# Altium schematic sheet Phaser.schdoc: Phaser
size 420 x 297 mm; EDA_Number: ARTIQ; Projet: ARTIQ/SINARA; Author: G.Kasprowicz; CompanyName: WUT ISE; DrawnBy: G.Kasprowicz; Organization: WUT ISE; Address1: PW ISE; Address2: Nowowiejska 15/19 00-665 Warsaw; Address3: gkasprow@gmail.com; Revision: 2; SheetNumber: -; SheetTotal: -; ModifiedBy: -; CheckedDate: -; Title2: xxx; DivGrp: WUT ISE; Designer: G.Kasprowicz; ModifiedDate: -; ProjectName: Sensor Box
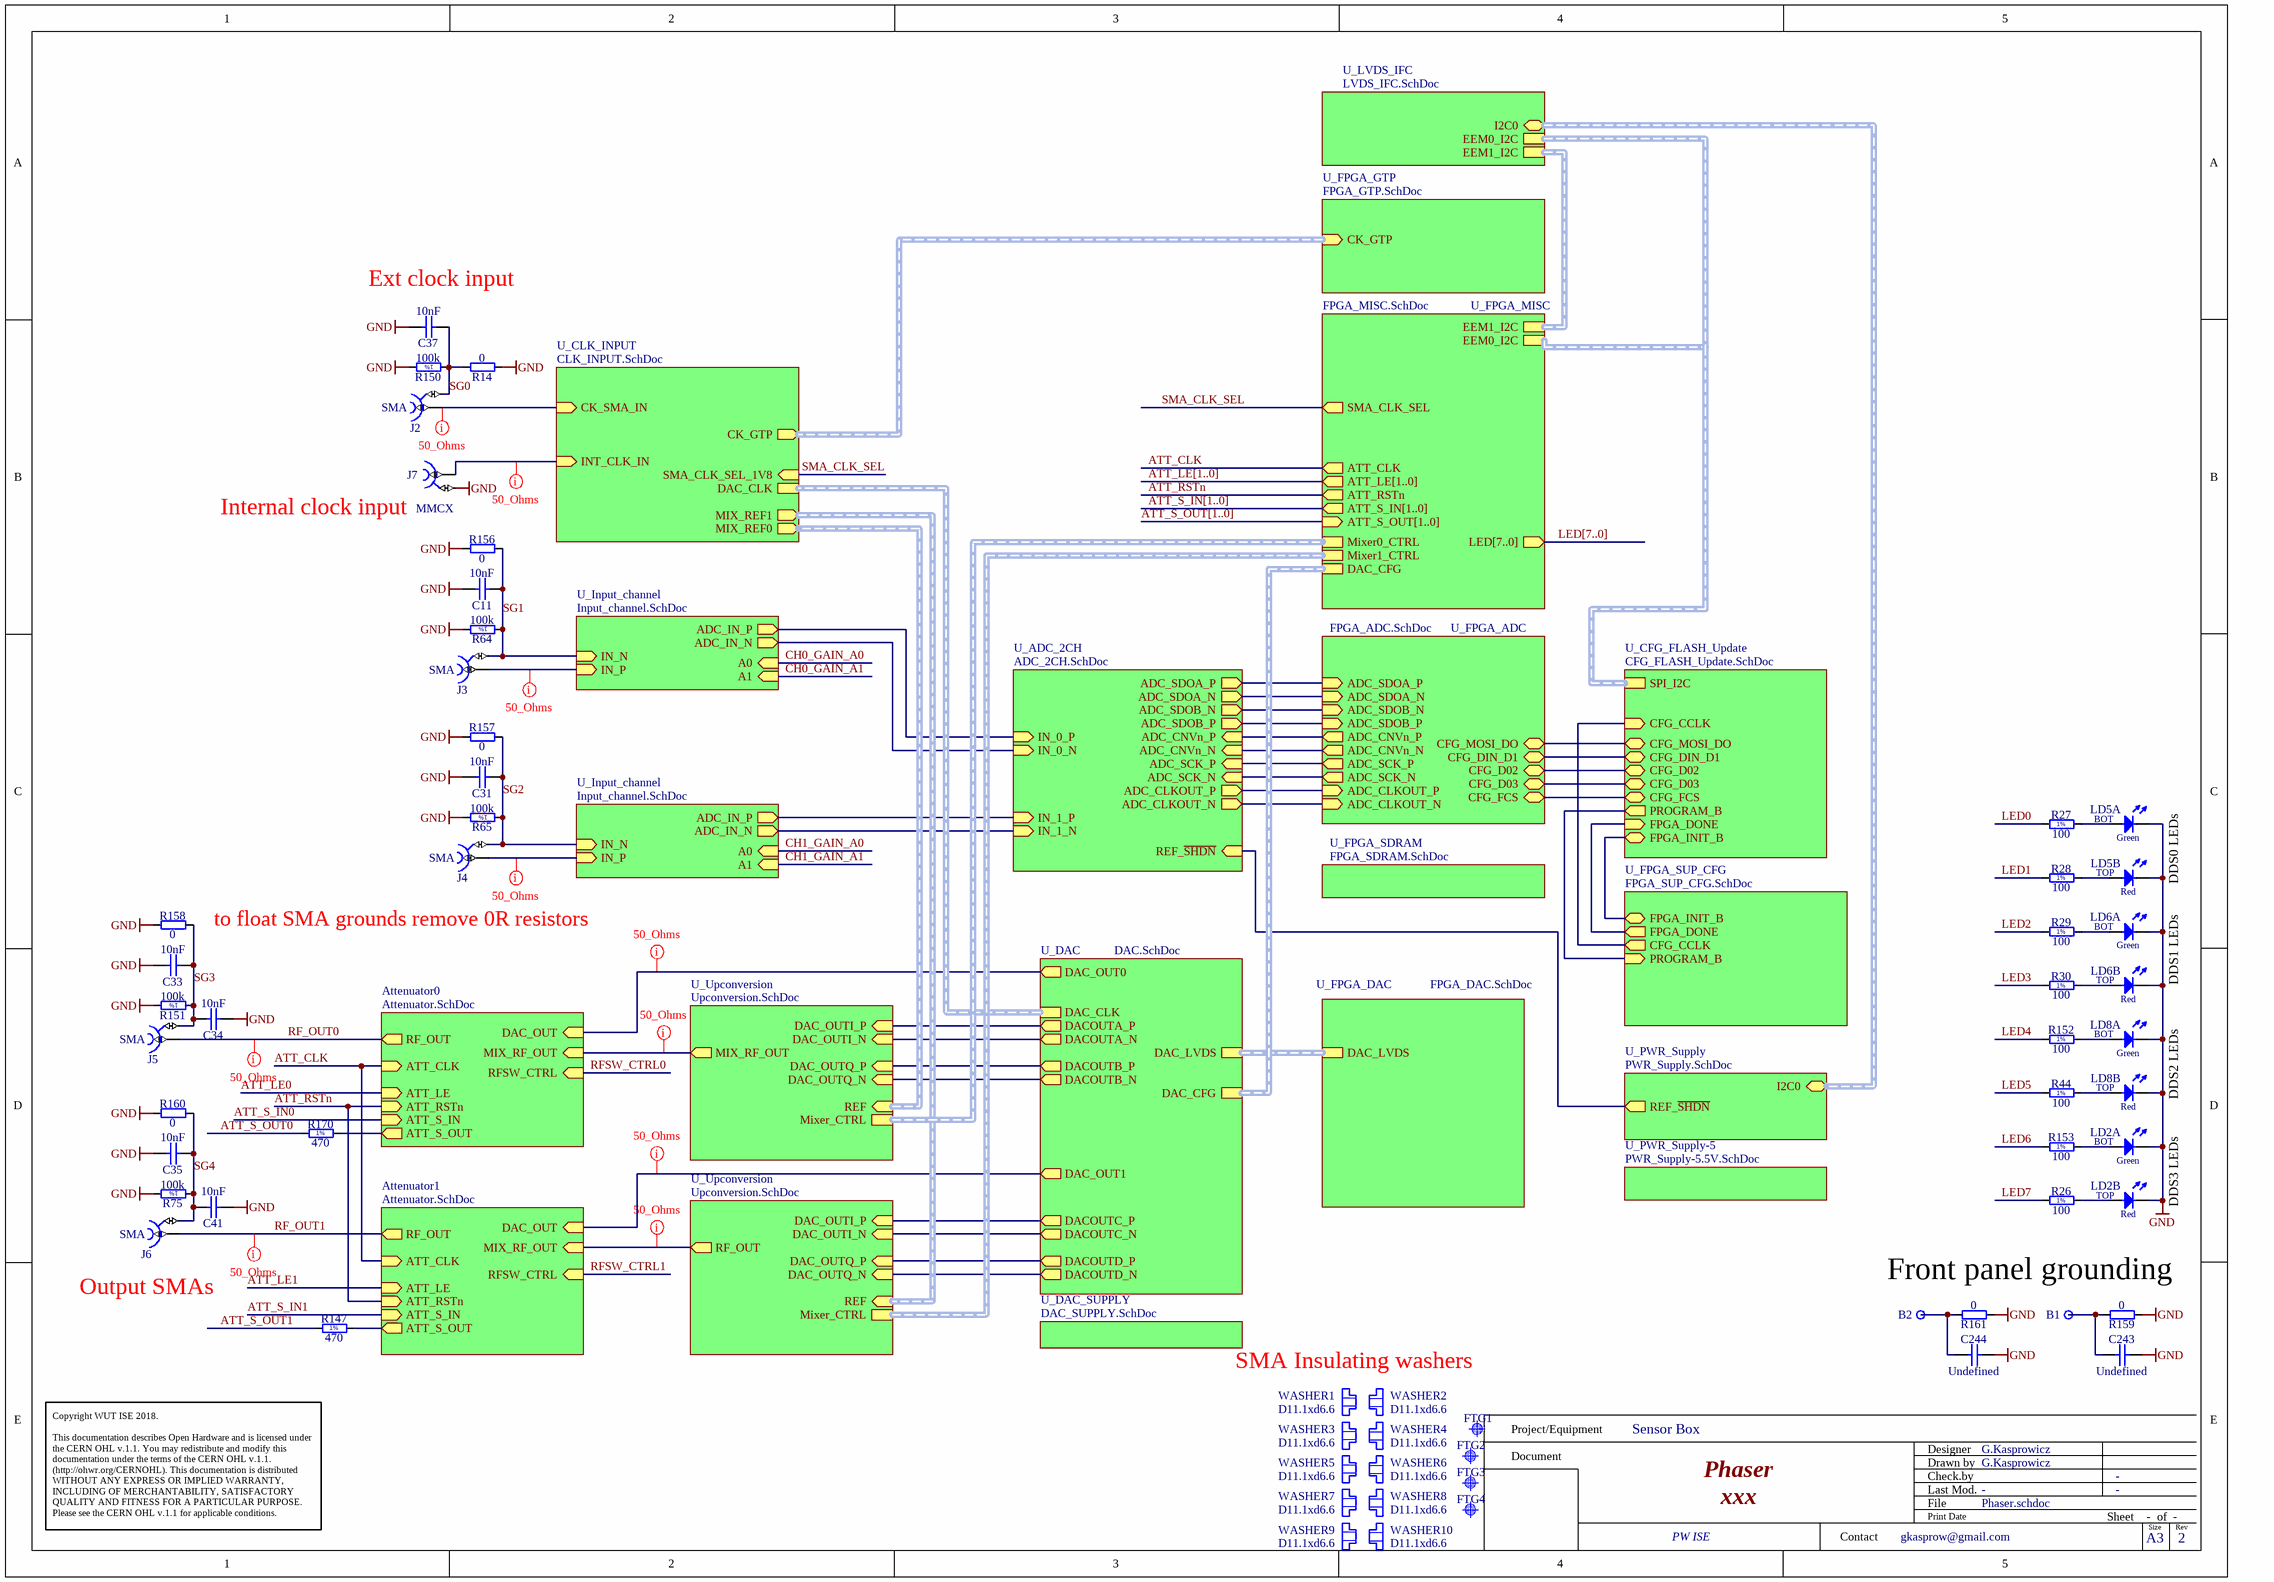
[diagram p0: Phaser.schdoc]

## Parts
B1  Plated Hole  [MTG270_500]  (value not drawn)
B2  Plated Hole  [MTG270_500]  (value not drawn)
C11  10nF  [CAPC1005X55N]
C31  10nF  [CAPC1005X55N]
C33  10nF  [CAPC1005X55N]
C34  10nF  [CAPC1005X55N]
C35  10nF  [CAPC1005X55N]
C37  10nF  [CAPC1005X55N]
C41  10nF  [CAPC1005X55N]
C243  Undefined  [CAPC2012X135N]
C244  Undefined  [CAPC2012X135N]
FTG1  Use only in PCB  [FIDUCIAL_TOP_C100-200]  (value not drawn)
FTG2  Use only in PCB  [FIDUCIAL_TOP_S100-200]  (value not drawn)
FTG3  Use only in PCB  [FIDUCIAL_TOP_S200-400]  (value not drawn)
FTG4  Use only in PCB  [FIDUCIAL_TOP_S100-200]  (value not drawn)
J2  SMA  [RF249BT0050GHDW]
J3  SMA  [RF249BT0050GHDW]
J4  SMA  [RF249BT0050GHDW]
J5  SMA  [RF249BT0050GHDW]
J6  SMA  [RF249BT0050GHDW]
J7  MMCX  [SAMTEC_MMCX-J-P-H-ST-TH1]
LD2  Red/Green  [LED_DIALIGHT_571-0112F]  (value not drawn)  (parts A,B of 2)
LD5  Red/Green  [LED_DIALIGHT_571-0112F]  (value not drawn)  (parts A,B of 2)
LD6  Red/Green  [LED_DIALIGHT_571-0112F]  (value not drawn)  (parts A,B of 2)
LD8  Red/Green  [LED_DIALIGHT_571-0112F]  (value not drawn)  (parts A,B of 2)
R14  0  [RESC1608X55N]
R26  100  [RESC1005X40N]
R27  100  [RESC1005X40N]
R28  100  [RESC1005X40N]
R29  100  [RESC1005X40N]
R30  100  [RESC1005X40N]
R44  100  [RESC1005X40N]
R64  100k  [RESC1005X40N]
R65  100k  [RESC1005X40N]
R75  100k  [RESC1005X40N]
R147  470  [RESC1005X40N]
R150  100k  [RESC1005X40N]
R151  100k  [RESC1005X40N]
R152  100  [RESC1005X40N]
R153  100  [RESC1005X40N]
R156  0  [RESC1608X55N]
R157  0  [RESC1608X55N]
R158  0  [RESC1608X55N]
R159  0  [RESC1608X55N]
R160  0  [RESC1608X55N]
R161  0  [RESC1608X55N]
R170  470  [RESC1005X40N]
WASHER1  D11.1xd6.6  [Keystone_7687]
WASHER2  D11.1xd6.6  [Keystone_7687]
WASHER3  D11.1xd6.6  [Keystone_7687]
WASHER4  D11.1xd6.6  [Keystone_7687]
WASHER5  D11.1xd6.6  [Keystone_7687]
WASHER6  D11.1xd6.6  [Keystone_7687]
WASHER7  D11.1xd6.6  [Keystone_7687]
WASHER8  D11.1xd6.6  [Keystone_7687]
WASHER9  D11.1xd6.6  [Keystone_7687]
WASHER10  D11.1xd6.6  [Keystone_7687]

## Sub-sheets
Attenuator0 = Attenuator.SchDoc: RF_OUT (out), RFSW_CTRL (in), ATT_CLK (in), ATT_S_IN (in), ATT_LE (in), ATT_RSTn (in), ATT_S_OUT (out), DAC_OUT (in), MIX_RF_OUT (in)
Attenuator1 = Attenuator.SchDoc: RF_OUT (out), RFSW_CTRL (in), ATT_CLK (in), ATT_S_IN (in), ATT_LE (in), ATT_RSTn (in), ATT_S_OUT (out), DAC_OUT (in), MIX_RF_OUT (in)
U_ADC_2CH = ADC_2CH.SchDoc: ADC_SDOA_P (out), ADC_SDOA_N (out), ADC_SDOB_N (out), ADC_SDOB_P (out), ADC_CLKOUT_P (out), ADC_CLKOUT_N (out), ADC_SCK_P (in), ADC_SCK_N (in), REF_~{SHDN} (in), ADC_CNVn_P (in), ADC_CNVn_N (in), IN_0_P (in), IN_1_P (in), IN_0_N (in), IN_1_N (in)
U_CFG_FLASH_Update = CFG_FLASH_Update.SchDoc: SPI_I2C (harness I2C), CFG_MOSI_DO (bidir), CFG_DIN_D1 (bidir), CFG_D02 (bidir), CFG_D03 (bidir), CFG_FCS (bidir), CFG_CCLK (in), FPGA_DONE (in), FPGA_INIT_B (bidir), PROGRAM_B (out)
U_CLK_INPUT = CLK_INPUT.SchDoc: CK_SMA_IN (in), INT_CLK_IN (in), SMA_CLK_SEL_1V8 (in), CK_GTP (out, harness CLKDIFF), MIX_REF0 (out), MIX_REF1 (out), DAC_CLK
U_DAC = DAC.SchDoc: DAC_CFG (harness DAC_CFG), DAC_LVDS (harness DAC_LVDS), DAC_CLK (harness CLKDIFF), DACOUTD_P (out), DACOUTA_P (out), DACOUTA_N (out), DACOUTD_N (out), DACOUTC_N (out), DACOUTC_P (out), DACOUTB_N (out), DACOUTB_P (out), DAC_OUT0 (out), DAC_OUT1 (out)
U_DAC_SUPPLY = DAC_SUPPLY.SchDoc: no entries
U_FPGA_ADC = FPGA_ADC.SchDoc: ADC_SDOA_P (in), ADC_SDOA_N (in), ADC_SDOB_N (in), ADC_SDOB_P (in), ADC_CNVn_P (out), ADC_CNVn_N (out), ADC_SCK_P (out), ADC_SCK_N (out), ADC_CLKOUT_P (in), ADC_CLKOUT_N (in), CFG_DIN_D1 (bidir), CFG_FCS (bidir), CFG_MOSI_DO (bidir), CFG_D02 (bidir), CFG_D03 (bidir)
U_FPGA_DAC = FPGA_DAC.SchDoc: DAC_LVDS
U_FPGA_GTP = FPGA_GTP.SchDoc: CK_GTP (in, harness CLKDIFF)
U_FPGA_MISC = FPGA_MISC.SchDoc: SMA_CLK_SEL (out), ATT_CLK (out), ATT_RSTn (out), ATT_LE[1..0] (out), ATT_S_IN[1..0] (out), ATT_S_OUT[1..0] (in), DAC_CFG (harness SPI), LED[7..0] (out), EEM1_I2C (harness I2C), EEM0_I2C (harness I2C), Mixer1_CTRL, Mixer0_CTRL
U_FPGA_SDRAM = FPGA_SDRAM.SchDoc: no entries
U_FPGA_SUP_CFG = FPGA_SUP_CFG.SchDoc: FPGA_INIT_B (bidir), FPGA_DONE (out), CFG_CCLK (out), PROGRAM_B (in)
U_Input_channel = Input_channel.SchDoc: IN_N (in), A0 (in), A1 (in), IN_P (in), ADC_IN_P (out), ADC_IN_N (out)
U_Input_channel = Input_channel.SchDoc: IN_N (in), A0 (in), A1 (in), IN_P (in), ADC_IN_P (out), ADC_IN_N (out)
U_LVDS_IFC = LVDS_IFC.SchDoc: I2C0 (bidir, harness I2C), EEM1_I2C, EEM0_I2C
U_PWR_Supply = PWR_Supply.SchDoc: I2C0 (bidir), REF_~{SHDN} (out)
U_PWR_Supply-5 = PWR_Supply-5.5V.SchDoc: no entries
U_Upconversion = Upconversion.SchDoc: DAC_OUTI_P (in), DAC_OUTI_N (in), DAC_OUTQ_N (in), DAC_OUTQ_P (in), REF (in, harness CLKDIFF), MIX_RF_OUT (out), Mixer_CTRL (harness Mixer_CTRL)
U_Upconversion = Upconversion.SchDoc: DAC_OUTI_P (in), DAC_OUTI_N (in), DAC_OUTQ_N (in), DAC_OUTQ_P (in), REF (in, harness CLKDIFF), RF_OUT (out), Mixer_CTRL (harness Mixer_CTRL)

## Nets
GND: C11.2 C31.2 C33.2 C34.1 C35.2 C37.2 C41.1 C243.2 C244.2 J7.2 LD2.1(C) LD2.3(C) LD5.1(C) LD5.3(C) LD6.1(C) LD6.3(C) LD8.1(C) LD8.3(C) R14.1 R64.1 R65.1 R75.1 R150.1 R151.1 R156.1 R157.1 R158.1 R159.1 R160.1 R161.1
ATT_CLK: sheet Attenuator0/ATT_CLK, sheet Attenuator1/ATT_CLK, sheet U_FPGA_MISC/ATT_CLK
ATT_LE0: sheet Attenuator0/ATT_LE
ATT_LE1: sheet Attenuator1/ATT_LE
ATT_RSTn: sheet Attenuator0/ATT_RSTn, sheet Attenuator1/ATT_RSTn, sheet U_FPGA_MISC/ATT_RSTn
ATT_S_IN0: sheet Attenuator0/ATT_S_IN
ATT_S_IN1: sheet Attenuator1/ATT_S_IN
ATT_S_OUT0: R170.1
ATT_S_OUT1: R147.1
CH0_GAIN_A0: sheet U_Input_channel/A0
CH0_GAIN_A1: sheet U_Input_channel/A1
CH1_GAIN_A0: sheet U_Input_channel/A0
CH1_GAIN_A1: sheet U_Input_channel/A1
LED0: R27.1
LED1: R28.1
LED2: R29.1
LED3: R30.1
LED4: R152.1
LED5: R44.1
LED6: R153.1
LED7: R26.1
RF_OUT0: J5.1 ; sheet Attenuator0/RF_OUT
RF_OUT1: J6.1 ; sheet Attenuator1/RF_OUT
RFSW_CTRL0: sheet Attenuator0/RFSW_CTRL
RFSW_CTRL1: sheet Attenuator1/RFSW_CTRL
SG0: C37.1 J2.2 R14.2 R150.2
SG1: C11.1 J3.2 R64.2 R156.2 ; sheet U_Input_channel/IN_N
SG2: C31.1 J4.2 R65.2 R157.2 ; sheet U_Input_channel/IN_N
SG3: C33.1 C34.2 J5.2 R151.2 R158.2
SG4: C35.1 C41.2 J6.2 R75.2 R160.2
SMA_CLK_SEL: sheet U_FPGA_MISC/SMA_CLK_SEL, sheet U_CLK_INPUT/SMA_CLK_SEL_1V8
NetB1_1: B1.1 C243.1 R159.2
NetB2_1: B2.1 C244.1 R161.2
NetJ2_1: J2.1 ; sheet U_CLK_INPUT/CK_SMA_IN
NetJ3_1: J3.1 ; sheet U_Input_channel/IN_P
NetJ4_1: J4.1 ; sheet U_Input_channel/IN_P
NetJ7_1: J7.1 ; sheet U_CLK_INPUT/INT_CLK_IN
NetLD2_2: LD2.2(A) R153.2
NetLD2_4: LD2.4(A) R26.2
NetLD5_2: LD5.2(A) R27.2
NetLD5_4: LD5.4(A) R28.2
NetLD6_2: LD6.2(A) R29.2
NetLD6_4: LD6.4(A) R30.2
NetLD8_2: LD8.2(A) R152.2
NetLD8_4: LD8.4(A) R44.2
NetR147_2: R147.2 ; sheet Attenuator1/ATT_S_OUT
NetR170_2: R170.2 ; sheet Attenuator0/ATT_S_OUT
(unnamed): sheet Attenuator0/DAC_OUT, sheet U_DAC/DAC_OUT0
(unnamed): sheet Attenuator0/MIX_RF_OUT, sheet U_Upconversion/MIX_RF_OUT
(unnamed): sheet Attenuator1/DAC_OUT, sheet U_DAC/DAC_OUT1
(unnamed): sheet Attenuator1/MIX_RF_OUT, sheet U_Upconversion/RF_OUT
(unnamed): sheet U_PWR_Supply/REF_~{SHDN}, sheet U_ADC_2CH/REF_~{SHDN}
(unnamed): sheet U_ADC_2CH/ADC_SDOA_P, sheet U_FPGA_ADC/ADC_SDOA_P
(unnamed): sheet U_ADC_2CH/ADC_SDOA_N, sheet U_FPGA_ADC/ADC_SDOA_N
(unnamed): sheet U_ADC_2CH/ADC_SDOB_N, sheet U_FPGA_ADC/ADC_SDOB_N
(unnamed): sheet U_ADC_2CH/ADC_SDOB_P, sheet U_FPGA_ADC/ADC_SDOB_P
(unnamed): sheet U_ADC_2CH/ADC_CLKOUT_P, sheet U_FPGA_ADC/ADC_CLKOUT_P
(unnamed): sheet U_ADC_2CH/ADC_CLKOUT_N, sheet U_FPGA_ADC/ADC_CLKOUT_N
(unnamed): sheet U_ADC_2CH/ADC_SCK_P, sheet U_FPGA_ADC/ADC_SCK_P
(unnamed): sheet U_ADC_2CH/ADC_SCK_N, sheet U_FPGA_ADC/ADC_SCK_N
(unnamed): sheet U_ADC_2CH/ADC_CNVn_P, sheet U_FPGA_ADC/ADC_CNVn_P
(unnamed): sheet U_ADC_2CH/ADC_CNVn_N, sheet U_FPGA_ADC/ADC_CNVn_N
(unnamed): sheet U_ADC_2CH/IN_0_P, sheet U_Input_channel/ADC_IN_P
(unnamed): sheet U_ADC_2CH/IN_1_P, sheet U_Input_channel/ADC_IN_P
(unnamed): sheet U_ADC_2CH/IN_0_N, sheet U_Input_channel/ADC_IN_N
(unnamed): sheet U_ADC_2CH/IN_1_N, sheet U_Input_channel/ADC_IN_N
(unnamed): sheet U_DAC/DACOUTD_P, sheet U_Upconversion/DAC_OUTQ_P
(unnamed): sheet U_DAC/DACOUTA_P, sheet U_Upconversion/DAC_OUTI_P
(unnamed): sheet U_DAC/DACOUTA_N, sheet U_Upconversion/DAC_OUTI_N
(unnamed): sheet U_DAC/DACOUTD_N, sheet U_Upconversion/DAC_OUTQ_N
(unnamed): sheet U_DAC/DACOUTC_N, sheet U_Upconversion/DAC_OUTI_N
(unnamed): sheet U_DAC/DACOUTC_P, sheet U_Upconversion/DAC_OUTI_P
(unnamed): sheet U_DAC/DACOUTB_N, sheet U_Upconversion/DAC_OUTQ_N
(unnamed): sheet U_DAC/DACOUTB_P, sheet U_Upconversion/DAC_OUTQ_P
(unnamed): sheet U_FPGA_ADC/CFG_DIN_D1, sheet U_CFG_FLASH_Update/CFG_DIN_D1
(unnamed): sheet U_FPGA_ADC/CFG_FCS, sheet U_CFG_FLASH_Update/CFG_FCS
(unnamed): sheet U_FPGA_ADC/CFG_MOSI_DO, sheet U_CFG_FLASH_Update/CFG_MOSI_DO
(unnamed): sheet U_FPGA_ADC/CFG_D02, sheet U_CFG_FLASH_Update/CFG_D02
(unnamed): sheet U_FPGA_ADC/CFG_D03, sheet U_CFG_FLASH_Update/CFG_D03
(unnamed): sheet U_FPGA_SUP_CFG/FPGA_INIT_B, sheet U_CFG_FLASH_Update/FPGA_INIT_B
(unnamed): sheet U_FPGA_SUP_CFG/FPGA_DONE, sheet U_CFG_FLASH_Update/FPGA_DONE
(unnamed): sheet U_FPGA_SUP_CFG/CFG_CCLK, sheet U_CFG_FLASH_Update/CFG_CCLK
(unnamed): sheet U_FPGA_SUP_CFG/PROGRAM_B, sheet U_CFG_FLASH_Update/PROGRAM_B

## Buses and harness runs
bus ATT_LE[1..0] = sheet U_FPGA_MISC/ATT_LE[1..0]
bus ATT_S_IN[1..0] = sheet U_FPGA_MISC/ATT_S_IN[1..0]
bus ATT_S_OUT[1..0] = sheet U_FPGA_MISC/ATT_S_OUT[1..0]
bus LED[7..0] = sheet U_FPGA_MISC/LED[7..0]
harness sheet U_CFG_FLASH_Update/SPI_I2C = sheet U_FPGA_MISC/EEM0_I2C = sheet U_LVDS_IFC/EEM0_I2C
harness sheet U_CLK_INPUT/CK_GTP = sheet U_FPGA_GTP/CK_GTP
harness sheet U_CLK_INPUT/DAC_CLK = sheet U_DAC/DAC_CLK
harness sheet U_CLK_INPUT/MIX_REF0 = sheet U_Upconversion/REF
harness sheet U_CLK_INPUT/MIX_REF1 = sheet U_Upconversion/REF
harness sheet U_DAC/DAC_CFG = sheet U_FPGA_MISC/DAC_CFG
harness sheet U_DAC/DAC_LVDS = sheet U_FPGA_DAC/DAC_LVDS
harness sheet U_FPGA_MISC/EEM1_I2C = sheet U_LVDS_IFC/EEM1_I2C
harness sheet U_FPGA_MISC/Mixer0_CTRL = sheet U_Upconversion/Mixer_CTRL
harness sheet U_FPGA_MISC/Mixer1_CTRL = sheet U_Upconversion/Mixer_CTRL
harness sheet U_LVDS_IFC/I2C0 = sheet U_PWR_Supply/I2C0

## Layout directives
net class 50_Ohms: (no net found under the mark), NetJ2_1, NetJ3_1, NetJ4_1, NetJ7_1, RF_OUT0, RF_OUT1

## Notes on the sheet
- (near C37) Ext clock input
- (near J7) Internal clock input
- (near LD5) DDS0 LEDs
- (near LD6) DDS1 LEDs
- (near LD8) DDS2 LEDs
- (near LD2) DDS3 LEDs
- (near J6) Output SMAs
- Front panel grounding
- SMA Insulating washers
- Labels drawn without touching a wire or pin: to float SMA grounds remove 0R resistors
- Project/Equipment
- Document
- Designer
- Drawn by
- Check.by
- Copyright WUT ISE 2018.
  This documentation describes Open Hardware and is licensed under the CERN OHL v.1.1. You may redistribute and modify this documentation under the terms of the CERN OHL v.1.1. (http://ohwr.org/CERNOHL). This documentation is distributed WITHOUT ANY EXPRESS OR IMPLIED WARRANTY, INCLUDING OF MERCHANTABILITY, SATISFACTORY QUALITY AND FITNESS FOR A PARTICULAR PURPOSE. Please see the CERN OHL v.1.1 for applicable conditions.
- Contact
- File
- Last Mod.
- Print Date
- Sheet
- Size
- A3
- of
- Rev
- (in symbol LED_DIALIGHT_571-0112F, part A) BOT; Green
- (in symbol LED_DIALIGHT_571-0112F, part B) TOP; Red
- (in symbol R0402_100K_1%_0.0625W_100PPM) 1%
- (in symbol R0402_100R_1%_0.0625W_100PPM) 1%
- (in symbol R0402_470R_1%_0.0625W_100PPM) 1%

## Library data of the parts
B1 B2 = PLATED_HOLE2.7_PAD5.0: Single Terminal Socket; Part Description: Plated Through Hole: Hole Dia.=2.7mm Pad Dia.=5.0mm; Mounted: No; Part Number: PLATED_HOLE2.7_PAD5.0; Component Kind: Standard (No BOM); Component Type: Standard (No BOM); Pin Count: 1; Family: Plated Hole; Socket: No; SMD: No; Sense: No; Status: None; ComponentHeight: 0mm; HelpURL: Undefined; Author: CERN DEM JMW; CreateDate: 27.09.2011; LatestRevisionDate: 27.09.2011; PackageDescription: Plated Through Hole: Hole Dia.=2.7mm Pad Dia.=5.0mm
C11 C31 C33-C35 C37 C41 = CC0402_10NF_16V_10%_X7R: Non-polarised capacitor; Part Description: SMD Multilayer Chip Ceramic Capacitor; Manufacturer: GENERIC; Manufacturer1 Part Number: 223878715636; Voltage: 16V; TC: X7R; Tolerance: ±10%; Part Number: CC0402_10NF_16V_10%_X7R; Component Kind: Standard; Component Type: Standard; Pin Count: 2; Value: 10nF; Status: Not Recommended; Manufacturer Part Number: CC0402_10NF_16V_10%_X7R; Case: 0402; Mounted: Yes; Socket: No; SMD: Yes; Sense: No; Manufacturer1 Example: PHYCOMP; Manufacturer1 ComponentHeight: 0.55mm; HelpURL: \\cern.ch\dfs\Applications\Altium\Datasheets\CC0402_X7R_PHYCOMP.pdf; Author: CERN DEM JLC; CreateDate: 2007-12-03; LatestRevisionDate: 2007-12-03
C243 C244 = CC0805_NO-VALUE: Non-polarised capacitor; Part Description: Reserved Footprint For 0805(2012) Chip Ceramic Capacitor; Mounted: No; Part Number: CC0805_NO-VALUE; Component Kind: Standard; Component Type: Standard; Pin Count: 2; Value: Undefined; Status: None; Manufacturer: Undefined; Manufacturer Part Number: CC0805_NO-VALUE; Case: 0805; Socket: No; SMD: Yes; Sense: No; Manufacturer1 ComponentHeight: 1.35mm; HelpURL: Undefined; Author: CERN DEM JLC; CreateDate: 10.12.2008; LatestRevisionDate: 11.09.2013
FTG1 = FIDUCIAL_TARGET_C100-200: Fiducial Target; Part Description: Round Fiducial Target, Top Layer, 1.0mm, Top Solder 2.0mm, Keepout =2.0mm; Mounted: No; Part Number: FIDUCIAL_TARGET_C100-200; Component Kind: Standard (No BOM); Component Type: Standard (No BOM); Pin Count: 1; Family: Fiducial; Socket: No; SMD: Yes; Sense: No; Status: None; ComponentHeight: 0mm; HelpURL: Undefined; Author: CERN DEM JLC; CreateDate: 09.02.2010; LatestRevisionDate: 04.04.2012; PackageDescription: Round Fiducial Target, Top Layer, 1.0mm, Top Solder 2.0mm, Keepout =2.0mm
FTG2 FTG4 = FIDUCIAL_TARGET_S100-200: Fiducial Target; Part Description: Square Fiducial Target, Top Layer, 1.0mm, Top Solder 2.0mm, Keepout =2.0mm; Mounted: No; Part Number: FIDUCIAL_TARGET_S100-200; Component Kind: Standard (No BOM); Component Type: Standard (No BOM); Pin Count: 1; Family: Fiducial; Socket: No; SMD: Yes; Sense: No; Status: None; ComponentHeight: 0mm; HelpURL: Undefined; Author: CERN DEM JLC; CreateDate: 09.02.2010; LatestRevisionDate: 04.04.2012; PackageDescription: Square Fiducial Target, Top Layer, 1.0mm, Top Solder 2.0mm, Keepout =2.0mm
FTG3 = FIDUCIAL_TARGET_S200-400: Fiducial Target; Part Description: Square Fiducial Target, Top Layer, 2.0mm, Top Solder 4.0mm, Keepout =4.0mm; Mounted: No; Part Number: FIDUCIAL_TARGET_S200-400; Component Kind: Standard (No BOM); Component Type: Standard (No BOM); Pin Count: 1; Family: Fiducial; Socket: No; SMD: Yes; Sense: No; Status: None; ComponentHeight: 0mm; HelpURL: Undefined; Author: CERN DEM JLC; CreateDate: 02.06.2008; LatestRevisionDate: 04.04.2012; PackageDescription: Square Fiducial Target, Top Layer, 2.0mm, Top Solder 4.0mm, Keepout =4.0mm
J2-J6 = CON_SMA_RF249BT0050GHDW: 50 Ohm Through Hole SMA Right Angle PCB Jack; Part Number: AdamTech_RF249BT0050GHDW; Manufacturer: AdamTech; PressFit: No; Component Kind: Standard; Component Type: Standard; Pin Count: 5; Family: SMA; Mounted: Yes; Socket: No; SMD: No; Sense: No; Status: None; Part Description: 50 Ohm Through Hole SMA Right Angle PCB Jack; Manufacturer Part Number: RF249BT0050GHDW; ComponentHeight: 10.44mm; HelpURL: \\cern.ch\dfs\Applications\Altium\Datasheets\AMPHENOL_132203.pdf; Author: GK; CreateDate: 06.10.2016; LatestRevisionDate: 06.10.2016
J7 = SAMTEC_MMCX-J-P-H-ST-TH1: Part Description: Straight Through-hole 50 Ohm Micro Mini RF Jack, MMCX Series; Manufacturer: SAMTEC; PressFit: No; Part Number: SAMTEC_MMCX-J-P-H-ST-TH1; Component Kind: Standard; Component Type: Standard; Pin Count: 2; Mounted: Yes; Socket: No; Sense: No; SMD: No; Status: None; Manufacturer Part Number: MMCX-J-P-H-ST-TH1; ComponentHeight: 4.35mm; HelpURL: \\cern.ch\dfs\Applications\Altium\Datasheets\SAMTEC_MMCX-J-P-H-ST-TH1.pdf; Author: CERN DEM JLC; CreateDate: 05.12.2012; LatestRevisionDate: 05.12.2012
LD2 LD5 LD6 LD8 = LED_DIALIGHT_571-0112F: 2x LED  Botom Green, Top Red; Part Description: Dual 2mm  LEDs, Red Top,Green Bot, CBI® Circuit Board Indicator (Without positioning pins); PressFit: No; Bonding: No; Part Number: LED_DIALIGHT_571-0112F; Component Kind: Standard; Component Type: Standard; Color: Red/Green; PackageDescription: 2x 2mm LED (Top: Red, Bot: Green) PCB Edge Mounting (Without positioning pins) DIALIGHT 571 Serie; Manufacturer: DIALIGHT; Manufacturer Part Number: 571-0112F; Pin Count: 4; Mounted: Yes; Socket: No; SMD: No; Sense: No; ComponentHeight: 8.6mm; HelpURL: \\cern.ch\dfs\Applications\Altium\Datasheets\LED_DIALIGHT_571-0112F.pdf; Author: CERN DEM JLC; CreateDate: 09.11.2009; LatestRevisionDate: 17.03.2010
R14 R156-R161 = R0603_0R_JUMPER: Resistor; Part Description: 1A (0.05R Max DC Resistance) Zero Ohm Jumper; Manufacturer: GENERIC; Manufacturer1 Part Number: NRC06Z0; PressFit: No; Part Number: R0603_0R_JUMPER; Component Kind: Standard; Component Type: Standard; Pin Count: 2; Value: 0; Status: Preferred; Manufacturer Part Number: R0603_0R_JUMPER; Case: 0603; Mounted: Yes; Sense: No; Socket: No; SMD: Yes; Manufacturer1 Example: NIC COMPONENT; Manufacturer1 ComponentHeight: 0.55mm; HelpURL: \\cern.ch\dfs\Applications\Altium\Datasheets\R0603_NIC_NRC.pdf; Author: CERN DEM JLC; CreateDate: 03.12.2007; LatestRevisionDate: 13.03.2008
R26-R30 R44 R152 R153 = R0402_100R_1%_0.0625W_100PPM: Resistor - 1%; Part Description: General Purpose Thick Film Chip Resistor; Manufacturer: GENERIC; Manufacturer1 Part Number: 232270671001L; TC: ±100ppm/°C; PressFit: No; Part Number: R0402_100R_1%_0.0625W_100PPM; Component Kind: Standard; Component Type: Standard; Pin Count: 2; Value: 100; Status: Not Recommended; Power: 0.0625W; Tolerance: ±1%; Manufacturer Part Number: R0402_100R_1%_0.0625W_100PPM; Case: 0402; Mounted: Yes; Sense: No; Socket: No; SMD: Yes; Manufacturer1 Example: YAGEO PHYCOMP; Manufacturer1 ComponentHeight: 0.4mm; HelpURL: \\cern.ch\dfs\Applications\Altium\Datasheets\R0402_Phycomp_RC0402.pdf; Author: CERN DEM JLC; CreateDate: 03.12.2007; LatestRevisionDate: 17.10.2012
R64 R65 R75 R150 R151 = R0402_100K_1%_0.0625W_100PPM: Resistor - 1%; Part Description: General Purpose Thick Film Chip Resistor; Manufacturer: GENERIC; Manufacturer1 Part Number: 232270671004L; PressFit: No; TC: ±100ppm/°C; Part Number: R0402_100K_1%_0.0625W_100PPM; Component Kind: Standard; Component Type: Standard; Pin Count: 2; Value: 100k; Status: Not Recommended; Manufacturer Part Number: R0402_100K_1%_0.0625W_100PPM; Case: 0402; Mounted: Yes; Sense: No; Socket: No; SMD: Yes; Manufacturer1 Example: YAGEO PHYCOMP; Manufacturer1 ComponentHeight: 0.4mm; HelpURL: \\cern.ch\dfs\Applications\Altium\Datasheets\R0402_Phycomp_RC0402.pdf; Author: CERN DEM JLC; CreateDate: 03.12.2007; LatestRevisionDate: 17.10.2012; Power: 0.0625W; Tolerance: ±1%
R147 R170 = R0402_470R_1%_0.0625W_100PPM: Resistor - 1%; Part Description: General Purpose Thick Film Chip Resistor; Manufacturer: GENERIC; Manufacturer1 Part Number: 232270674701L; TC: ±100ppm/°C; PressFit: No; Part Number: R0402_470R_1%_0.0625W_100PPM; Component Kind: Standard; Component Type: Standard; Pin Count: 2; Value: 470; Status: Not Recommended; Power: 0.0625W; Tolerance: ±1%; Manufacturer Part Number: R0402_470R_1%_0.0625W_100PPM; Case: 0402; Mounted: Yes; Sense: No; Socket: No; SMD: Yes; Manufacturer1 Example: YAGEO PHYCOMP; Manufacturer1 ComponentHeight: 0.4mm; HelpURL: \\cern.ch\dfs\Applications\Altium\Datasheets\R0402_Phycomp_RC0402.pdf; Author: CERN DEM JLC; CreateDate: 03.12.2007; LatestRevisionDate: 17.10.2012
WASHER1-WASHER10 = Keystone_7687: SMA_Shoulder Washer; Part Description: Polyphenylene Sulfide PPS Shoulder Washer; Manufacturer Part Number: 7687; PressFit: No; Part Number: Keystone 7687; Component Kind: Standard; Component Type: Mechanical; Pin Count: 0; PackageDescription: Polyphenylene Sulfide PPS Shoulder Washer; Mounted: Yes; Socket: No; SMD: No; Sense: No; Status: None; Value: D11.1xd6.6; Manufacturer: Keystone; ComponentHeight: 1.91mm; HelpURL: \\cern.ch\dfs\Applications\Altium\Datasheets\AAVID-THERMALLOY_7721-7PPSG.pdf; Author: GK; CreateDate: 28.01.2016; LatestRevisionDate: 28.01.2016